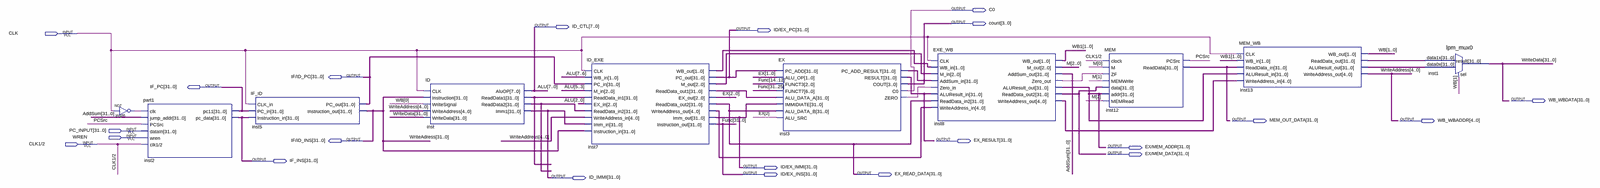
[diagram p0: schematic sheet, whole]
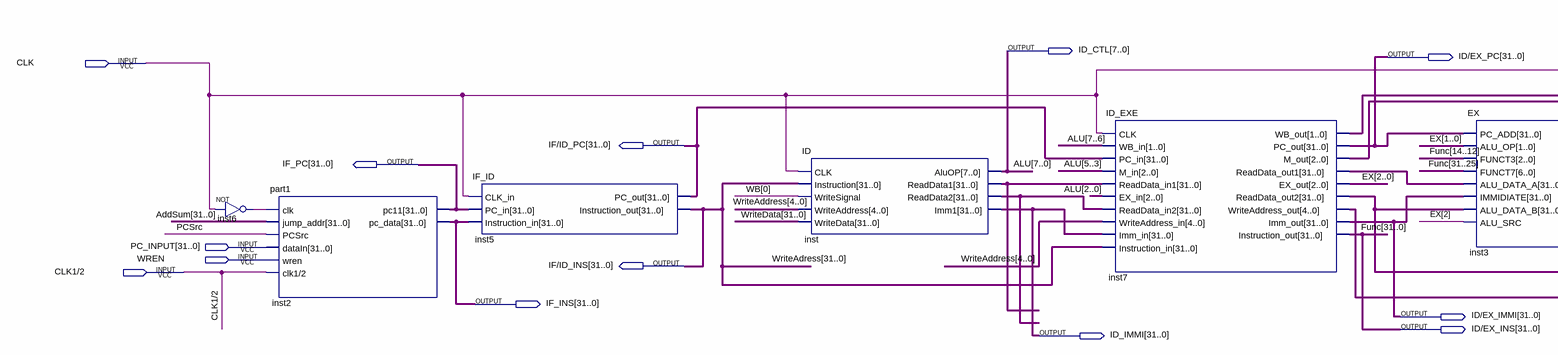
[diagram p1: schematic sheet, left part]
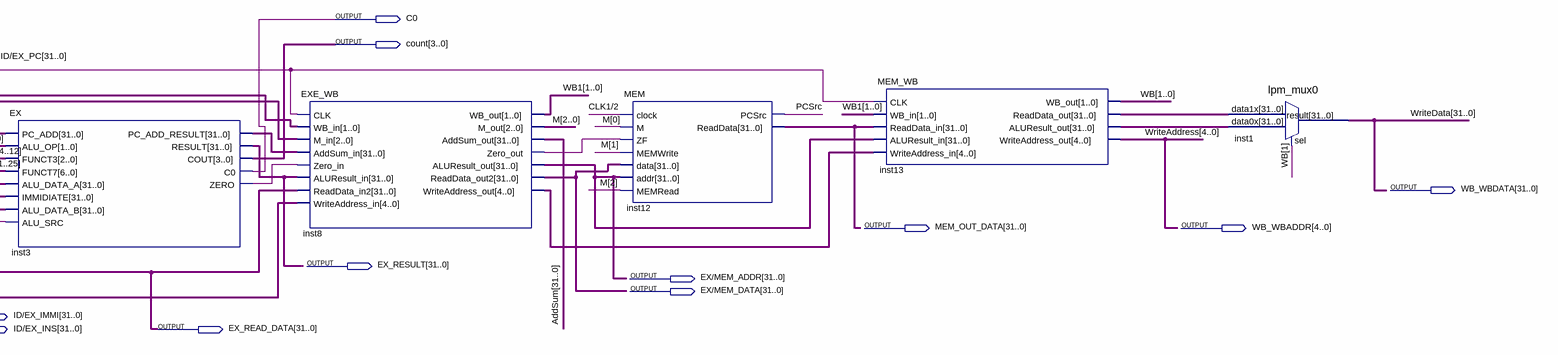
[diagram p2: schematic sheet, right part]
// Quartus schematic RISC-V_32bit.bdf as structural Verilog: 10 symbols, 22 pins
module \RISC-V_32bit  (
  input  CLK,
  input  [31:0] PC_INPUT,
  input  WREN,
  input  \CLK1/2 ,
  output C0,
  output [3:0] count,
  output [7:0] ID_CTL,
  output [31:0] \ID/EX_PC ,
  output [31:0] \IF/ID_PC ,
  output [31:0] IF_PC,
  output [31:0] WB_WBDATA,
  output [31:0] MEM_OUT_DATA,
  output [4:0] WB_WBADDR,
  output [31:0] \IF/ID_INS ,
  output [31:0] EX_RESULT,
  output [31:0] \EX/MEM_ADDR ,
  output [31:0] \EX/MEM_DATA ,
  output [31:0] IF_INS,
  output [31:0] \ID/EX_IMMI ,
  output [31:0] \ID/EX_INS ,
  output [31:0] EX_READ_DATA,
  output [31:0] ID_IMMI
);

  wire inst3_zero, inst6_out, inst8_zero_out, PCSrc;
  wire [1:0] inst7_wb_out, WB, WB1;
  wire [2:0] EX, inst7_m_out, M;
  wire [4:0] inst7_writeaddress_out, inst8_writeaddress_out;
  wire [31:0] AddSum, inst3_pc_add_result, inst7_readdata_out1, inst13_aluresult_out, inst13_readdata_out,
       inst_readdata1, inst_readdata2;

  not inst6 (inst6_out, CLK);
  part1 inst2 (
    .clk(inst6_out), .jump_addr(AddSum), .PCSrc(PCSrc), .dataIn(PC_INPUT), .wren(WREN), .\clk1/2 (\CLK1/2 ),
    .pc11(IF_PC), .pc_data(IF_INS));
  IF_ID inst5 (
    .CLK_in(CLK), .PC_in(IF_PC), .Instruction_in(IF_INS), .PC_out(\IF/ID_PC ), .Instruction_out(\IF/ID_INS ));
  ID inst (
    .CLK(CLK), .Instruction(\IF/ID_INS ), .WriteSignal(WB[0]), .WriteAddress(WB_WBADDR),
    .WriteData(WB_WBDATA), .AluOP(ID_CTL), .ReadData1(inst_readdata1), .ReadData2(inst_readdata2),
    .Imm1(ID_IMMI));
  ID_EXE inst7 (
    .CLK(CLK), .WB_in(ID_CTL[7:6]), .PC_in(\IF/ID_PC ), .M_in(ID_CTL[5:3]), .ReadData_in1(inst_readdata1),
    .EX_in(ID_CTL[2:0]), .ReadData_in2(inst_readdata2), .WriteAddress_in(WB_WBADDR), .Imm_in(ID_IMMI),
    .Instruction_in(\IF/ID_INS ), .WB_out(inst7_wb_out), .PC_out(\ID/EX_PC ), .M_out(inst7_m_out),
    .ReadData_out1(inst7_readdata_out1), .EX_out(EX), .ReadData_out2(EX_READ_DATA),
    .WriteAddress_out(inst7_writeaddress_out), .Imm_out(\ID/EX_IMMI ), .Instruction_out(\ID/EX_INS ));
  EX inst3 (
    .PC_ADD(\ID/EX_PC ), .ALU_OP(EX[1:0]), .FUNCT3(\ID/EX_INS [14:12]), .FUNCT7(\ID/EX_INS [31:25]),
    .ALU_DATA_A(inst7_readdata_out1), .IMMIDIATE(\ID/EX_IMMI ), .ALU_DATA_B(EX_READ_DATA), .ALU_SRC(EX[2]),
    .PC_ADD_RESULT(inst3_pc_add_result), .RESULT(EX_RESULT), .COUT(count), .C0(C0), .ZERO(inst3_zero));
  EXE_WB inst8 (
    .CLK(CLK), .WB_in(inst7_wb_out), .M_in(inst7_m_out), .AddSum_in(inst3_pc_add_result),
    .Zero_in(inst3_zero), .ALUResult_in(EX_RESULT), .ReadData_in2(EX_READ_DATA),
    .WriteAddress_in(inst7_writeaddress_out), .WB_out(WB1), .M_out(M), .AddSum_out(AddSum),
    .Zero_out(inst8_zero_out), .ALUResult_out(\EX/MEM_ADDR ), .ReadData_out2(\EX/MEM_DATA ),
    .WriteAddress_out(inst8_writeaddress_out));
  MEM inst12 (
    .clock(\CLK1/2 ), .M(M[0]), .ZF(inst8_zero_out), .MEMWrite(M[1]), .data(\EX/MEM_DATA ),
    .addr(\EX/MEM_ADDR ), .MEMRead(M[2]), .PCSrc(PCSrc), .ReadData(MEM_OUT_DATA));
  MEM_WB inst13 (
    .CLK(CLK), .WB_in(WB1), .ReadData_in(MEM_OUT_DATA), .ALUResult_in(\EX/MEM_ADDR ),
    .WriteAddress_in(inst8_writeaddress_out), .WB_out(WB), .ReadData_out(inst13_readdata_out),
    .ALUResult_out(inst13_aluresult_out), .WriteAddress_out(WB_WBADDR));
  lpm_mux0 inst1 (.data1x(inst13_readdata_out), .data0x(inst13_aluresult_out), .sel(WB[1]), .result(WB_WBDATA));

  // Other names for the same wires on the sheet: Func[31:0] = \ID/EX_INS ; ALU[7:0] = ID_CTL;
  //   WriteAddress[4:0] = WB_WBADDR; WriteData[31:0] = WB_WBDATA; WriteAdress[31:0] = \IF/ID_INS 
endmodule
